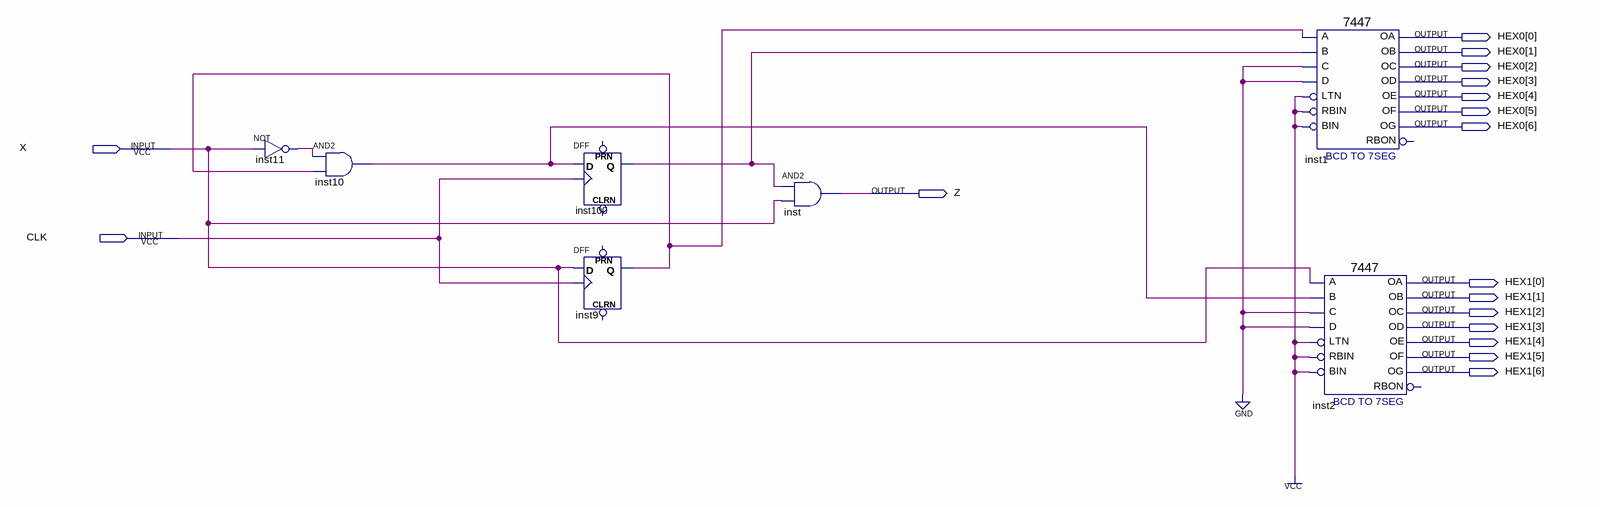
[diagram p0: schematic sheet]
// Quartus schematic Mealy.bdf as structural Verilog: 7 symbols, 17 pins
module Mealy (
  input  X,
  input  CLK,
  output [6:0] HEX0,
  output Z,
  output [6:0] HEX1
);

  wire inst9_q, inst10_out, inst11_out, inst100_q;

  not inst11 (inst11_out, X);
  and inst10 (inst10_out, inst11_out, inst9_q);
  DFF inst100 (.CLK(CLK), .D(inst10_out), .Q(inst100_q));  // open: CLRN, PRN
  DFF inst9 (.CLK(CLK), .D(X), .Q(inst9_q));  // open: CLRN, PRN
  and inst (Z, inst100_q, X);
  \7447  inst1 (
    .LTN(1'b1), .B(inst100_q), .C(1'b0), .D(1'b0), .RBIN(1'b1), .BIN(1'b1), .A(inst9_q), .OB(HEX0[1]),
    .OC(HEX0[2]), .OE(HEX0[4]), .OD(HEX0[3]), .OF(HEX0[5]), .OG(HEX0[6]), .OA(HEX0[0]));  // open: RBON
  \7447  inst2 (
    .LTN(1'b1), .B(inst10_out), .C(1'b0), .D(1'b0), .RBIN(1'b1), .BIN(1'b1), .A(X), .OB(HEX1[1]),
    .OC(HEX1[2]), .OE(HEX1[4]), .OD(HEX1[3]), .OF(HEX1[5]), .OG(HEX1[6]), .OA(HEX1[0]));  // open: RBON
endmodule
